# EAGLE schematic BB-cape (EAGLE 9.7.0)
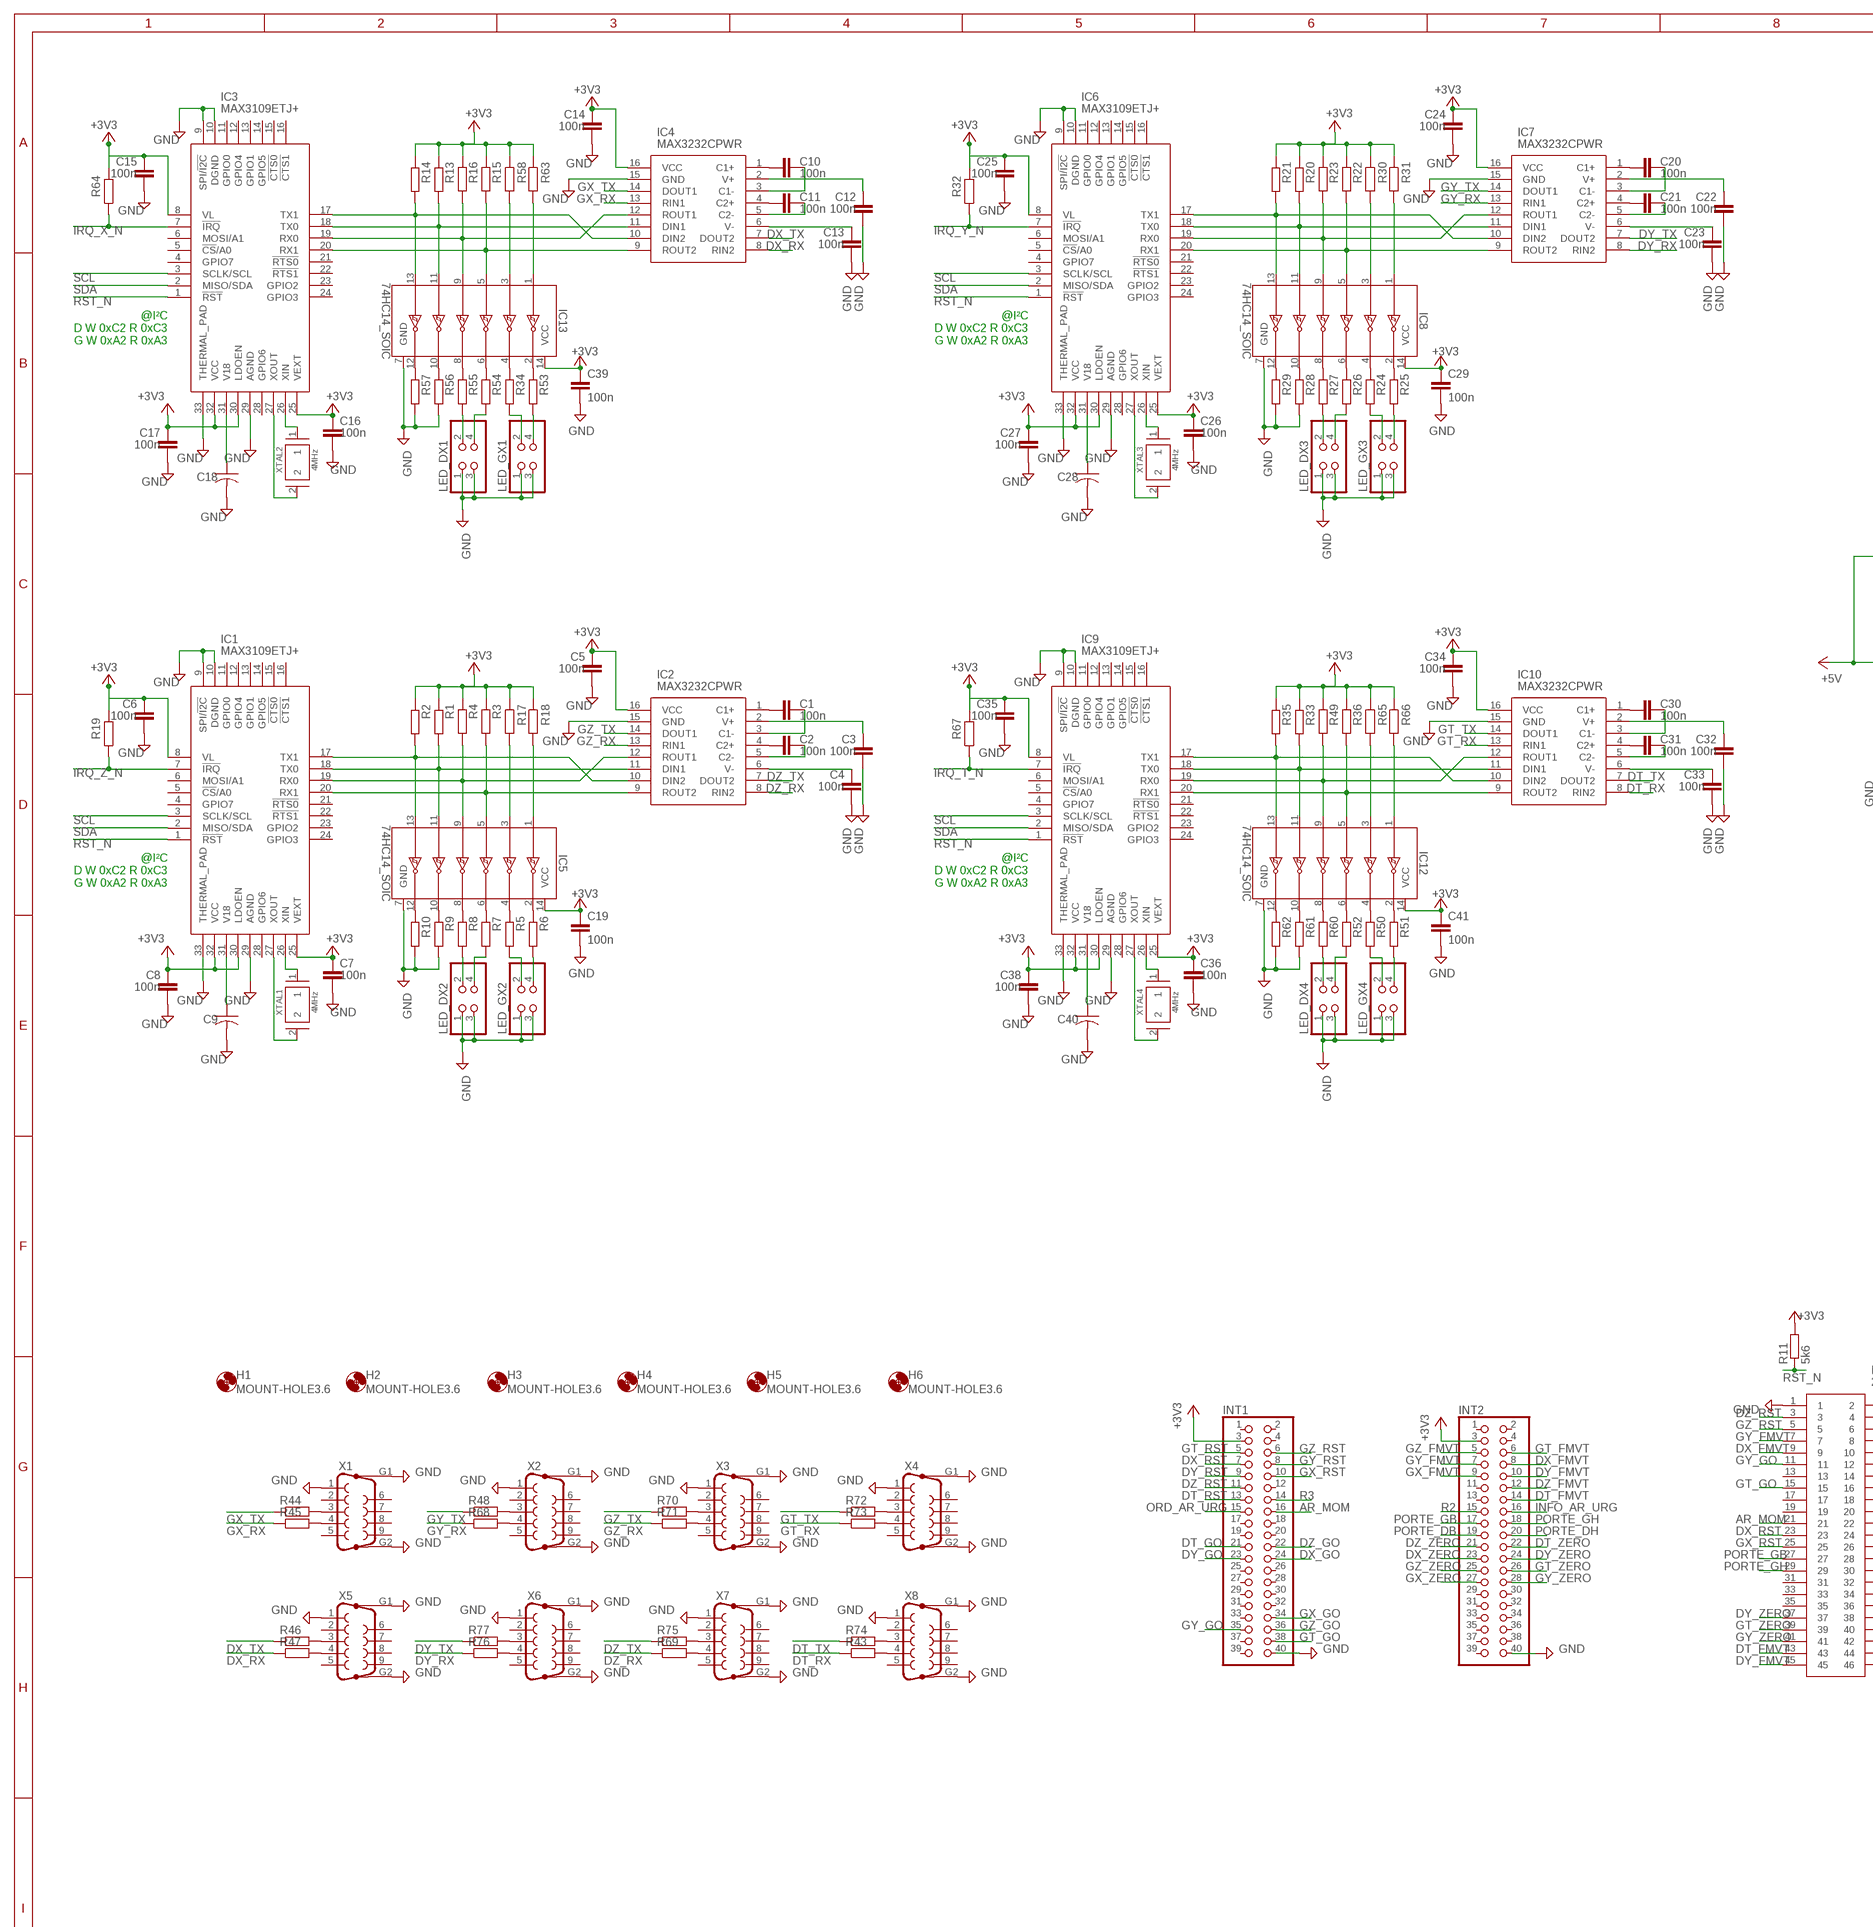
[diagram p0: schematic, sheet 1, part 1 of 2]
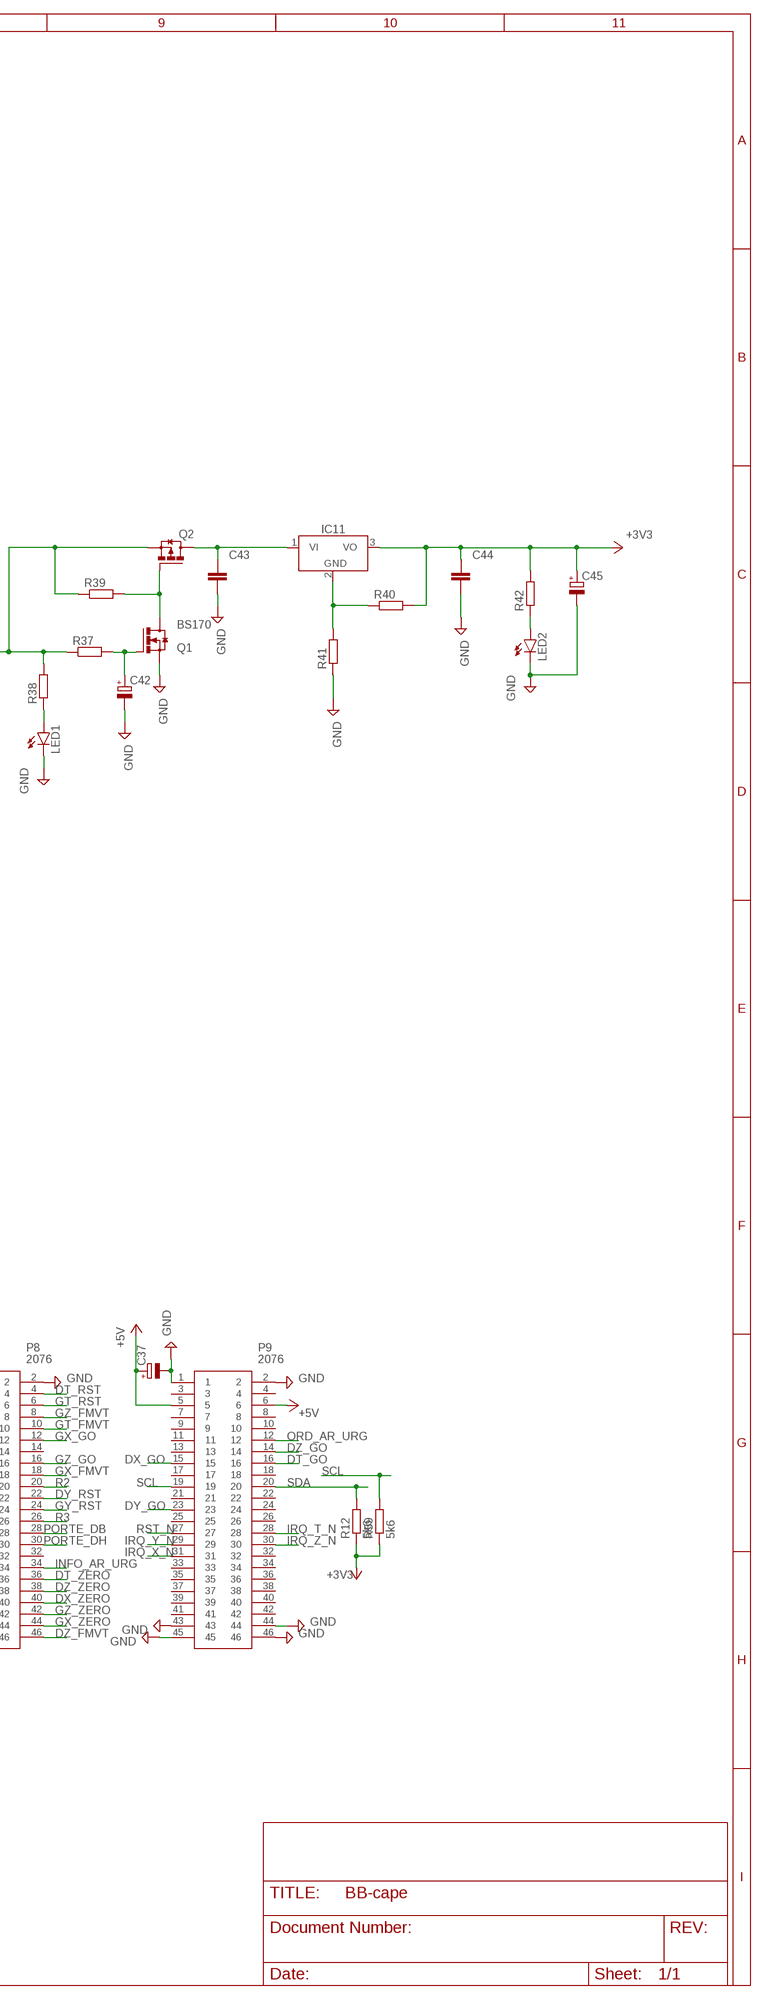
[diagram p1: schematic, sheet 1, part 2 of 2]

## Parts
C1  100n  C-EUC0603  [C0603]
C2  100n  C-EUC0603  [C0603]
C3  100n  C-EUC0603  [C0603]
C4  100n  C-EUC0603  [C0603]
C5  100n  C-EUC0603  [C0603]
C6  100n  C-EUC0603  [C0603]
C7  100n  C-EUC0603  [C0603]
C8  100n  C-EUC0603  [C0603]
C9  C-USC1206  [C1206]
C10  100n  C-EUC0603  [C0603]
C11  100n  C-EUC0603  [C0603]
C12  100n  C-EUC0603  [C0603]
C13  100n  C-EUC0603  [C0603]
C14  100n  C-EUC0603  [C0603]
C15  100n  C-EUC0603  [C0603]
C16  100n  C-EUC0603  [C0603]
C17  100n  C-EUC0603  [C0603]
C18  C-USC1206  [C1206]
C19  100n  C-EUC0603  [C0603]
C20  100n  C-EUC0603  [C0603]
C21  100n  C-EUC0603  [C0603]
C22  100n  C-EUC0603  [C0603]
C23  100n  C-EUC0603  [C0603]
C24  100n  C-EUC0603  [C0603]
C25  100n  C-EUC0603  [C0603]
C26  100n  C-EUC0603  [C0603]
C27  100n  C-EUC0603  [C0603]
C28  C-USC1206  [C1206]
C29  100n  C-EUC0603  [C0603]
C30  100n  C-EUC0603  [C0603]
C31  100n  C-EUC0603  [C0603]
C32  100n  C-EUC0603  [C0603]
C33  100n  C-EUC0603  [C0603]
C34  100n  C-EUC0603  [C0603]
C35  100n  C-EUC0603  [C0603]
C36  100n  C-EUC0603  [C0603]
C37  CPOL-EUE2.5-6  [E2,5-6]
C38  100n  C-EUC0603  [C0603]
C39  100n  C-EUC0603  [C0603]
C40  C-USC1206  [C1206]
C41  100n  C-EUC0603  [C0603]
C42  CPOL-EUE2.5-6  [E2,5-6]
C43  C_CHIP-1210(3225-METRIC)  [CAPC3225X135]
C44  C_CHIP-1210(3225-METRIC)  [CAPC3225X135]
C45  CPOL-EUE2.5-6  [E2,5-6]
H1  MOUNT-HOLE3.6  [3,6]
H2  MOUNT-HOLE3.6  [3,6]
H3  MOUNT-HOLE3.6  [3,6]
H4  MOUNT-HOLE3.6  [3,6]
H5  MOUNT-HOLE3.6  [3,6]
H6  MOUNT-HOLE3.6  [3,6]
IC1  MAX3109ETJ+  [QFN50P500X500X80-33N]
IC2  MAX3232CPWR  [SOP65P640X120-16N]
IC3  MAX3109ETJ+  [QFN50P500X500X80-33N]
IC4  MAX3232CPWR  [SOP65P640X120-16N]
IC5  74HC14_SOIC  [SOIC127P600X175-14N]
IC6  MAX3109ETJ+  [QFN50P500X500X80-33N]
IC7  MAX3232CPWR  [SOP65P640X120-16N]
IC8  74HC14_SOIC  [SOIC127P600X175-14N]
IC9  MAX3109ETJ+  [QFN50P500X500X80-33N]
IC10  MAX3232CPWR  [SOP65P640X120-16N]
IC11  LM7805_TO220V  [TO220V]
IC12  74HC14_SOIC  [SOIC127P600X175-14N]
IC13  74HC14_SOIC  [SOIC127P600X175-14N]
INT1  PINHD-2X20  [2X20]
INT2  PINHD-2X20  [2X20]
LED1  TLLY4400  [LED3MM]
LED2  TLLY4400  [LED3MM]
LED_DX1  PINHD-2X2  [2X02]
LED_DX2  PINHD-2X2  [2X02]
LED_DX3  PINHD-2X2  [2X02]
LED_DX4  PINHD-2X2  [2X02]
LED_GX1  PINHD-2X2  [2X02]
LED_GX2  PINHD-2X2  [2X02]
LED_GX3  PINHD-2X2  [2X02]
LED_GX4  PINHD-2X2  [2X02]
P8  2076  [HDRV46W64P254_2X23_5842X500X87]
P9  2076  [HDRV46W64P254_2X23_5842X500X87]
Q1  BS170  [TO92-3]
Q2  IRF9540PBF  [TO-220]
R1  R-EU_R0603  [R0603]
R2  R-EU_R0603  [R0603]
R3  R-EU_R0603  [R0603]
R4  R-EU_R0603  [R0603]
R5  R-EU_R0603  [R0603]
R6  R-EU_R0603  [R0603]
R7  R-EU_R0603  [R0603]
R8  R-EU_R0603  [R0603]
R9  R-EU_R0603  [R0603]
R10  R-EU_R0603  [R0603]
R11  5k6  R-EU_R0603  [R0603]
R12  5k6  R-EU_R0603  [R0603]
R13  R-EU_R0603  [R0603]
R14  R-EU_R0603  [R0603]
R15  R-EU_R0603  [R0603]
R16  R-EU_R0603  [R0603]
R17  R-EU_R0603  [R0603]
R18  R-EU_R0603  [R0603]
R19  R-EU_R0603  [R0603]
R20  R-EU_R0603  [R0603]
R21  R-EU_R0603  [R0603]
R22  R-EU_R0603  [R0603]
R23  R-EU_R0603  [R0603]
R24  R-EU_R0603  [R0603]
R25  R-EU_R0603  [R0603]
R26  R-EU_R0603  [R0603]
R27  R-EU_R0603  [R0603]
R28  R-EU_R0603  [R0603]
R29  R-EU_R0603  [R0603]
R30  R-EU_R0603  [R0603]
R31  R-EU_R0603  [R0603]
R32  R-EU_R0603  [R0603]
R33  R-EU_R0603  [R0603]
R34  R-EU_R0603  [R0603]
R35  R-EU_R0603  [R0603]
R36  R-EU_R0603  [R0603]
R37  R-EU_R0603  [R0603]
R38  R-EU_R0603  [R0603]
R39  R-EU_R0603  [R0603]
R40  R-EU_R0603  [R0603]
R41  R-EU_R0603  [R0603]
R42  R-EU_R0603  [R0603]
R43  R-EU_R0603  [R0603]
R44  R-EU_R0603  [R0603]
R45  R-EU_R0603  [R0603]
R46  R-EU_R0603  [R0603]
R47  R-EU_R0603  [R0603]
R48  R-EU_R0603  [R0603]
R49  R-EU_R0603  [R0603]
R50  R-EU_R0603  [R0603]
R51  R-EU_R0603  [R0603]
R52  R-EU_R0603  [R0603]
R53  R-EU_R0603  [R0603]
R54  R-EU_R0603  [R0603]
R55  R-EU_R0603  [R0603]
R56  R-EU_R0603  [R0603]
R57  R-EU_R0603  [R0603]
R58  R-EU_R0603  [R0603]
R59  5k6  R-EU_R0603  [R0603]
R60  R-EU_R0603  [R0603]
R61  R-EU_R0603  [R0603]
R62  R-EU_R0603  [R0603]
R63  R-EU_R0603  [R0603]
R64  R-EU_R0603  [R0603]
R65  R-EU_R0603  [R0603]
R66  R-EU_R0603  [R0603]
R67  R-EU_R0603  [R0603]
R68  R-EU_R0603  [R0603]
R69  R-EU_R0603  [R0603]
R70  R-EU_R0603  [R0603]
R71  R-EU_R0603  [R0603]
R72  R-EU_R0603  [R0603]
R73  R-EU_R0603  [R0603]
R74  R-EU_R0603  [R0603]
R75  R-EU_R0603  [R0603]
R76  R-EU_R0603  [R0603]
R77  R-EU_R0603  [R0603]
X1  F09HP  [F09HP]
X2  F09HP  [F09HP]
X3  F09HP  [F09HP]
X4  F09HP  [F09HP]
X5  F09HP  [F09HP]
X6  F09HP  [F09HP]
X7  F09HP  [F09HP]
X8  F09HP  [F09HP]
XTAL1  4MHz  ABLS  [XTAL1147X477X420N]
XTAL2  4MHz  ABLS  [XTAL1147X477X420N]
XTAL3  4MHz  ABLS  [XTAL1147X477X420N]
XTAL4  4MHz  ABLS  [XTAL1147X477X420N]

## Nets
+3V3: C5.1 C6.1 C7.2 C8.2 C14.1 C15.1 C16.2 C17.2 C19.2 C24.1 C25.1 C26.2 C27.2 C29.2 C34.1 C35.1 C36.2 C38.2 C39.2 C41.2 C44.1 C45.+ IC1.8(VL) IC1.25(VEXT) IC1.30(LDOEN) IC1.32(VCC) IC2.16(VCC) IC3.8(VL) IC3.25(VEXT) IC3.30(LDOEN) IC3.32(VCC) IC4.16(VCC) IC5.14(VCC) IC6.8(VL) IC6.25(VEXT) IC6.30(LDOEN) IC6.32(VCC) IC7.16(VCC) IC8.14(VCC) IC9.8(VL) IC9.25(VEXT) IC9.30(LDOEN) IC9.32(VCC) IC10.16(VCC) IC11.3(VO) IC12.14(VCC) IC13.14(VCC) INT1.3 INT2.3 R1.1 R2.1 R3.2 R4.2 R11.2 R12.1 R13.1 R14.1 R15.2 R16.2 R17.1 R18.1 R19.2 R20.1 R21.1 R22.2 R23.2 R30.1 R31.1 R32.2 R33.1 R35.1 R36.2 R40.2 R42.2 R49.2 R58.1 R59.1 R63.1 R64.2 R65.1 R66.1 R67.2
+5V: C37.+ P9.5 P9.6 Q2.S R37.1 R38.2 R39.1
AR_MOM: INT1.16 P8.21
DT_FMVT: INT2.14 P8.43
DT_GO: INT1.21 P9.16
DT_RST: INT1.13 P8.4
DT_RX: IC10.8(RIN2) R43.1
DT_TX: IC10.7(DOUT2) R74.1
DT_ZERO: INT2.22 P8.36
DX_FMVT: INT2.8 P8.9
DX_GO: INT1.24 P9.15
DX_RST: INT1.7 P8.23
DX_RX: IC4.8(RIN2) R47.1
DX_TX: IC4.7(DOUT2) R46.1
DX_ZERO: INT2.23 P8.40
DY_FMVT: INT2.10 P8.45
DY_GO: INT1.23 P9.23
DY_RST: INT1.9 P8.22
DY_RX: IC7.8(RIN2) R76.1
DY_TX: IC7.7(DOUT2) R77.1
DY_ZERO: INT2.24 P8.37
DZ_FMVT: INT2.12 P8.46
DZ_GO: INT1.22 P9.14
DZ_RST: INT1.11 P8.3
DZ_RX: IC2.8(RIN2) R69.1
DZ_TX: IC2.7(DOUT2) R75.1
DZ_ZERO: INT2.21 P8.38
GND: C3.1 C4.2 C5.2 C6.2 C7.1 C8.1 C9.2 C12.1 C13.2 C14.2 C15.2 C16.1 C17.1 C18.2 C19.1 C22.1 C23.2 C24.2 C25.2 C26.1 C27.1 C28.2 C29.1 C32.1 C33.2 C34.2 C35.2 C36.1 C37.- C38.1 C39.1 C40.2 C41.1 C42.- C43.2 C44.2 C45.- IC1.9(SPI/!I2C) IC1.10(DGND) IC1.29(AGND) IC1.33(THERMAL_PAD) IC2.15(GND) IC3.9(SPI/!I2C) IC3.10(DGND) IC3.29(AGND) IC3.33(THERMAL_PAD) IC4.15(GND) IC5.7(GND) IC6.9(SPI/!I2C) IC6.10(DGND) IC6.29(AGND) IC6.33(THERMAL_PAD) IC7.15(GND) IC8.7(GND) IC9.9(SPI/!I2C) IC9.10(DGND) IC9.29(AGND) IC9.33(THERMAL_PAD) IC10.15(GND) IC12.7(GND) IC13.7(GND) INT1.40 INT2.40 LED1.K(C) LED2.K(C) LED_DX1.1 LED_DX1.3 LED_DX2.1 LED_DX2.3 LED_DX3.1 LED_DX3.3 LED_DX4.1 LED_DX4.3 LED_GX1.1 LED_GX1.3 LED_GX2.1 LED_GX2.3 LED_GX3.1 LED_GX3.3 LED_GX4.1 LED_GX4.3 P8.1 P8.2 P9.1 P9.2 P9.43 P9.44 P9.45 P9.46 Q1.3(S) R9.2 R10.2 R28.2 R29.2 R41.1 R56.2 R57.2 R61.2 R62.2 X1.1 X1.G1 X1.G2 X2.1 X2.G1 X2.G2 X3.1 X3.G1 X3.G2 X4.1 X4.G1 X4.G2 X5.1 X5.G1 X5.G2 X6.1 X6.G1 X6.G2 X7.1 X7.G1 X7.G2 X8.1 X8.G1 X8.G2
GT_FMVT: INT2.6 P8.10
GT_GO: INT1.38 P8.15
GT_RST: INT1.5 P8.6
GT_RX: IC10.13(RIN1) R73.1
GT_TX: IC10.14(DOUT1) R72.1
GT_ZERO: INT2.26 P8.39
GX_FMVT: INT2.9 P8.18
GX_GO: INT1.34 P8.12
GX_RST: INT1.10 P8.25
GX_RX: IC4.13(RIN1) R45.1
GX_TX: IC4.14(DOUT1) R44.1
GX_ZERO: INT2.27 P8.44
GY_FMVT: INT2.7 P8.7
GY_GO: INT1.35 P8.11
GY_RST: INT1.8 P8.24
GY_RX: IC7.13(RIN1) R68.1
GY_TX: IC7.14(DOUT1) R48.1
GY_ZERO: INT2.28 P8.41
GZ_FMVT: INT2.5 P8.8
GZ_GO: INT1.36 P8.16
GZ_RST: INT1.6 P8.5
GZ_RX: IC2.13(RIN1) R71.1
GZ_TX: IC2.14(DOUT1) R70.1
GZ_ZERO: INT2.25 P8.42
INFO_AR_URG: INT2.16 P8.34
IRQ_T_N: IC9.7(!IRQ) P9.28 R67.1
IRQ_X_N: IC3.7(!IRQ) P9.31 R64.1
IRQ_Y_N: IC6.7(!IRQ) P9.29 R32.1
IRQ_Z_N: IC1.7(!IRQ) P9.30 R19.1
N$1: C3.2 IC2.2(V+)
N$2: C1.1 IC2.3(C1-)
N$3: C2.1 IC2.5(C2-)
N$4: C4.1 IC2.6(V-)
N$5: IC1.26(XIN) XTAL1.1
N$6: IC1.27(XOUT) XTAL1.2
N$7: C42.+ Q1.2(G) R37.2
N$8: LED_DX2.2 R8.2
N$9: LED_DX2.4 R7.2
N$10: LED_GX2.2 R5.2
N$11: LED1.A R38.1
N$12: C12.2 IC4.2(V+)
N$13: Q1.1(D) Q2.G R39.2
N$14: LED_GX2.4 R6.2
N$15: C9.1 IC1.31(V18)
N$16: C10.1 IC4.3(C1-)
N$17: C11.1 IC4.5(C2-)
N$18: C13.1 IC4.6(V-)
N$19: IC3.26(XIN) XTAL2.1
N$20: IC3.27(XOUT) XTAL2.2
N$21: C43.1 IC11.1(VI) Q2.D
N$22: IC11.2(GND) R40.1 R41.2
N$23: IC1.17(TX1) IC2.10(DIN2) IC5.13(6A) R2.2
N$24: IC1.18(TX0) IC2.11(DIN1) IC5.11(5A) R1.2
N$25: IC1.19(RX0) IC2.12(ROUT1) IC5.9(4A) R4.1
N$26: LED_DX1.2 R55.2
N$27: IC1.20(RX1) IC2.9(ROUT2) IC5.5(3A) R3.1
N$28: IC5.3(2A) R17.2
N$29: IC5.1(1A) R18.2
N$30: C1.2 IC2.1(C1+)
N$31: R44.2 X1.3
N$32: LED2.A R42.1
N$33: R45.2 X1.4
N$34: C2.2 IC2.4(C2+)
N$35: IC5.4(2Y) R5.1
N$36: IC5.2(1Y) R6.1
N$37: IC5.6(3Y) R7.1
N$38: IC5.8(4Y) R8.1
N$39: IC5.10(5Y) R9.1
N$40: IC5.12(6Y) R10.1
N$41: C22.2 IC7.2(V+)
N$42: C20.1 IC7.3(C1-)
N$43: C21.1 IC7.5(C2-)
N$44: C23.1 IC7.6(V-)
N$45: IC6.26(XIN) XTAL3.1
N$46: IC6.27(XOUT) XTAL3.2
N$47: LED_DX3.2 R27.2
N$48: LED_DX3.4 R26.2
N$49: LED_GX3.2 R24.2
N$50: LED_GX3.4 R25.2
N$51: C28.1 IC6.31(V18)
N$52: IC6.17(TX1) IC7.10(DIN2) IC8.13(6A) R21.2
N$53: IC6.18(TX0) IC7.11(DIN1) IC8.11(5A) R20.2
N$54: IC6.19(RX0) IC7.12(ROUT1) IC8.9(4A) R23.1
N$55: IC6.20(RX1) IC7.9(ROUT2) IC8.5(3A) R22.1
N$56: IC8.3(2A) R30.2
N$57: IC8.1(1A) R31.2
N$58: C20.2 IC7.1(C1+)
N$59: C21.2 IC7.4(C2+)
N$60: IC8.4(2Y) R24.1
N$61: IC8.2(1Y) R25.1
N$62: IC8.6(3Y) R26.1
N$63: IC8.8(4Y) R27.1
N$64: IC8.10(5Y) R28.1
N$65: IC8.12(6Y) R29.1
N$66: C32.2 IC10.2(V+)
N$67: C30.1 IC10.3(C1-)
N$68: C31.1 IC10.5(C2-)
N$69: C33.1 IC10.6(V-)
N$70: LED_DX1.4 R54.2
N$71: LED_GX1.2 R34.2
N$72: IC9.26(XIN) XTAL4.1
N$73: LED_GX1.4 R53.2
N$74: C18.1 IC3.31(V18)
N$75: IC9.27(XOUT) XTAL4.2
N$76: LED_DX4.2 R60.2
N$77: IC3.17(TX1) IC4.10(DIN2) IC13.13(6A) R14.2
N$78: R46.2 X5.3
N$79: IC3.18(TX0) IC4.11(DIN1) IC13.11(5A) R13.2
N$80: LED_DX4.4 R52.2
N$81: IC3.19(RX0) IC4.12(ROUT1) IC13.9(4A) R16.1
N$82: LED_GX4.2 R50.2
N$83: LED_GX4.4 R51.2
N$84: IC3.20(RX1) IC4.9(ROUT2) IC13.5(3A) R15.1
N$85: C40.1 IC9.31(V18)
N$86: IC9.17(TX1) IC10.10(DIN2) IC12.13(6A) R35.2
N$87: IC13.3(2A) R58.2
N$88: IC9.18(TX0) IC10.11(DIN1) IC12.11(5A) R33.2
N$89: IC9.19(RX0) IC10.12(ROUT1) IC12.9(4A) R49.1
N$90: IC13.1(1A) R63.2
N$91: IC9.20(RX1) IC10.9(ROUT2) IC12.5(3A) R36.1
N$92: IC12.3(2A) R65.2
N$93: R47.2 X5.4
N$94: R48.2 X2.3
N$95: R68.2 X2.4
N$96: R70.2 X3.3
N$97: R71.2 X3.4
N$98: R69.2 X7.4
N$99: R72.2 X4.3
N$100: R73.2 X4.4
N$101: IC12.1(1A) R66.2
N$102: C30.2 IC10.1(C1+)
N$103: C31.2 IC10.4(C2+)
N$104: IC12.4(2Y) R50.1
N$105: IC12.2(1Y) R51.1
N$106: IC12.6(3Y) R52.1
N$107: C10.2 IC4.1(C1+)
N$108: C11.2 IC4.4(C2+)
N$109: R74.2 X8.3
N$110: R43.2 X8.4
N$111: IC13.4(2Y) R34.1
N$112: IC13.2(1Y) R53.1
N$113: IC12.8(4Y) R60.1
N$114: IC12.10(5Y) R61.1
N$115: IC13.6(3Y) R54.1
N$116: IC13.8(4Y) R55.1
N$117: IC12.12(6Y) R62.1
N$118: R75.2 X7.3
N$119: R76.2 X6.4
N$120: R77.2 X6.3
N$123: IC13.10(5Y) R56.1
N$124: IC13.12(6Y) R57.1
ORD_AR_URG: INT1.15 P9.12
PORTE_DB: INT2.19 P8.28
PORTE_DH: INT2.20 P8.30
PORTE_GB: INT2.17 P8.27
PORTE_GH: INT2.18 P8.29
R2: INT2.15 P8.20
R3: INT1.14 P8.26
RST_N: IC1.1(!RST) IC3.1(!RST) IC6.1(!RST) IC9.1(!RST) P9.27 R11.1
SCL: IC1.3(SCLK/SCL) IC3.3(SCLK/SCL) IC6.3(SCLK/SCL) IC9.3(SCLK/SCL) P9.19 R59.2
SDA: IC1.2(MISO/SDA) IC3.2(MISO/SDA) IC6.2(MISO/SDA) IC9.2(MISO/SDA) P9.20 R12.2
Unconnected: IC1.4(GPIO7) IC1.5(!CS!/A0) IC1.6(MOSI/A1) IC1.11(GPIO0) IC1.12(GPIO4) IC1.13(GPIO1) IC1.14(GPIO5) IC1.15(!CTS0) IC1.16(!CTS1) IC1.21(!RTS0) IC1.22(!RTS1) IC1.23(GPIO2) IC1.24(GPIO3) IC1.28(GPIO6) IC3.4(GPIO7) IC3.5(!CS!/A0) IC3.6(MOSI/A1) IC3.11(GPIO0) IC3.12(GPIO4) IC3.13(GPIO1) IC3.14(GPIO5) IC3.15(!CTS0) IC3.16(!CTS1) IC3.21(!RTS0) IC3.22(!RTS1) IC3.23(GPIO2) IC3.24(GPIO3) IC3.28(GPIO6) IC6.4(GPIO7) IC6.5(!CS!/A0) IC6.6(MOSI/A1) IC6.11(GPIO0) IC6.12(GPIO4) IC6.13(GPIO1) IC6.14(GPIO5) IC6.15(!CTS0) IC6.16(!CTS1) IC6.21(!RTS0) IC6.22(!RTS1) IC6.23(GPIO2) IC6.24(GPIO3) IC6.28(GPIO6) IC9.4(GPIO7) IC9.5(!CS!/A0) IC9.6(MOSI/A1) IC9.11(GPIO0) IC9.12(GPIO4) IC9.13(GPIO1) IC9.14(GPIO5) IC9.15(!CTS0) IC9.16(!CTS1) IC9.21(!RTS0) IC9.22(!RTS1) IC9.23(GPIO2) IC9.24(GPIO3) IC9.28(GPIO6) INT1.1 INT1.2 INT1.4 INT1.12 INT1.17 INT1.18 INT1.19 INT1.20 INT1.25 INT1.26 INT1.27 INT1.28 INT1.29 INT1.30 INT1.31 INT1.32 INT1.33 INT1.37 INT1.39 INT2.1 INT2.2 INT2.4 INT2.11 INT2.13 INT2.29 INT2.30 INT2.31 INT2.32 INT2.33 INT2.34 INT2.35 INT2.36 INT2.37 INT2.38 INT2.39 P8.13 P8.14 P8.17 P8.19 P8.31 P8.32 P8.33 P8.35 P9.3 P9.4 P9.7 P9.8 P9.9 P9.10 P9.11 P9.13 P9.17 P9.18 P9.21 P9.22 P9.24 P9.25 P9.26 P9.32 P9.33 P9.34 P9.35 P9.36 P9.37 P9.38 P9.39 P9.40 P9.41 P9.42 X1.2 X1.5 X1.6 X1.7 X1.8 X1.9 X2.2 X2.5 X2.6 X2.7 X2.8 X2.9 X3.2 X3.5 X3.6 X3.7 X3.8 X3.9 X4.2 X4.5 X4.6 X4.7 X4.8 X4.9 X5.2 X5.5 X5.6 X5.7 X5.8 X5.9 X6.2 X6.5 X6.6 X6.7 X6.8 X6.9 X7.2 X7.5 X7.6 X7.7 X7.8 X7.9 X8.2 X8.5 X8.6 X8.7 X8.8 X8.9

## Notes on the sheet
- @I²C
  D W 0xC2 R 0xC3
  G W 0xA2 R 0xA3
- @I²C
  D W 0xC2 R 0xC3
  G W 0xA2 R 0xA3
- @I²C
  D W 0xC2 R 0xC3
  G W 0xA2 R 0xA3
- @I²C
  D W 0xC2 R 0xC3
  G W 0xA2 R 0xA3

## Library data of the parts
C1-C8 C10-C17 C19-C27 C29-C36 C38 C39 C41 = rcl:C-EU: CAPACITOR, European symbol; SPICEPREFIX: C
C9 C18 C28 C40 = resistor:C-US: CAPACITOR, American symbol
C37 C42 C45 = rcl:CPOL-EU: POLARIZED CAPACITOR, European symbol; SPICEPREFIX: C
C43 C44 = Capacitor:C: Capacitor - Generic; CATEGORY: Capacitor
H1-H6 = holes:MOUNT-HOLE: MOUNTING HOLE with drill center marker
IC1 IC3 IC6 IC9 = SamacSys_Parts:MAX3109ETJ+: Maxim MAX3109ETJ+ Interface RS232, RS485 24MBps, 1.71 3.6 V, 32-Pin, TQFN Source: Datasheet <https://datasheets.maximintegrated.com/en/ds/MAX3109.pdf>; DESCRIPTION: Maxim MAX3109ETJ+ Interface RS232, RS485 24MBps, 1.71 3.6 V, 32-Pin, TQFN; HEIGHT: 0.8mm; MANUFACTURER_NAME: Analog Devices; MANUFACTURER_PART_NUMBER: MAX3109ETJ+; MOUSER_PART_NUMBER: 700-MAX3109ETJ+; MOUSER_PRICE-STOCK: https://www.mouser.co.uk/ProductDetail/Maxim-Integrated/MAX3109ETJ%2b?qs=LbY2dft4ljDeDesM43WgxA%3D%3D
IC2 IC4 IC7 IC10 = SamacSys_Parts:MAX3232CPWR: 3-V to 5.5-V multichannel RS-232 line driver & receiver Source: Datasheet <http://www.ti.com/lit/gpn/max3232>; ARROW_PART_NUMBER: MAX3232CPWR; ARROW_PRICE-STOCK: https://www.arrow.com/en/products/max3232cpwr/texas-instruments?region=nac; DESCRIPTION: 3-V to 5.5-V multichannel RS-232 line driver & receiver; HEIGHT: 1.2mm; MANUFACTURER_NAME: Texas Instruments; MANUFACTURER_PART_NUMBER: MAX3232CPWR; MOUSER_PART_NUMBER: 595-MAX3232CPWR; MOUSER_PRICE-STOCK: https://www.mouser.co.uk/ProductDetail/Texas-Instruments/MAX3232CPWR?qs=bkMXpVdiF40tDMAEI%2F4vWA%3D%3D
IC5 IC8 IC12 IC13 = IC_Logic:74HC14: Hex Inverters with Schmitt trigger Reference Datasheet <https://www.ti.com/lit/ds/symlink/sn74hc14.pdf?ts=1637585789037>; CATEGORY: IC_Logic; DESCRIPTION: Hex Inverters; MANUFACTURER: Generic; MPN: Generic; SUB-CATEGORY: Inverter; TYPE: Hex
IC11 = IC_Power-Management:LM7805: 5V Voltage Regulator Reference Datasheet <https://www.ti.com/lit/ds/symlink/lm340.pdf>; CATEGORY: IC_Linear; DESCRIPTION: 5V Voltage Regulator; MANUFACTURER: Generic; MPN: Generic; SERIES: LM7805; SUB-CATEGORY: Voltage Regulator; TYPE: 5V
INT1 INT2 = pinhead:PINHD-2X20: PIN HEADER
LED1 LED2 = led:TLLY4400: Low Current (2mA) LED 3 mm Tinted Diffused Package color YELLOW Source: Data sheet <http://www.farnell.com/datasheets/391098.pdf>; MF: VISHAY SEMICONDUCTOR; OC_FARNELL: 1612439
LED_DX1-LED_DX4 LED_GX1-LED_GX4 = pinhead:PINHD-2X2: PIN HEADER
P8 P9 = SamacSys_Parts:2076: Adafruit Accessories 2x23 Male Headers for BeagleBone Black - Two Pack Source: Datasheet <https://cdn-shop.adafruit.com/datasheets/16188.pdf>; ARROW_PART_NUMBER: 2076; ARROW_PRICE-STOCK: https://www.arrow.com/en/products/2076/adafruit-industries?region=nac; DESCRIPTION: Adafruit Accessories 2x23 Male Headers for BeagleBone Black - Two Pack; HEIGHT: 8.74mm; MANUFACTURER_NAME: Adafruit; MANUFACTURER_PART_NUMBER: 2076; MOUSER_PART_NUMBER: 485-2076; MOUSER_PRICE-STOCK: https://www.mouser.co.uk/ProductDetail/Adafruit/2076?qs=GURawfaeGuBAvD7rncVFUg%3D%3D
Q1 = Transistor:BS170: MOSFET N-CH 60V 300MA TO92-3 Manufacturer's datasheet <https://rocelec.widen.net/view/pdf/fonxoqycul/FAIRS29185-1.pdf?t.download=true&u=5oefqw>; CREATED_BY: PCBLayout.com; DIGIKEY_PART_NUMBER: 2156-BS170-ND; MANUFACTURER: Fairchild Semiconductor; MPN: BS170; PACKAGE: TO92-3
Q2 = Transistor:IRF9540PBF: MOSFET P-CH 100V 19A TO220AB Manufacturer's datasheet <https://www.vishay.com/docs/91078/91078.pdf>; CREATED_BY: PCBLayout.com; DIGIKEY_PART_NUMBER: IRF9540PBF-ND; MANUFACTURER: Vishay Siliconix; MPN: IRF9540PBF; PACKAGE: TO-220AB
R1-R77 = resistor:R-EU_: RESISTOR, European symbol
X1-X8 = con-subd:F09HP: SUB-D; OC_FARNELL: unknown; OC_NEWARK: unknown
XTAL1-XTAL4 = Frequency-Source:ABLS: HC/49US (AT49) SMD LOW PROFILE CRYSTAL Datasheet <https://abracon.com/Resonators/abls.pdf>; CATEGORY: HC/49US (AT49) SMD LOW PROFILE CRYSTAL; DESCRIPTION: Crystal 16MHZ SMD 11.5 x 4.7 x 4.2 mm; FREQUENCY: 16MHZ; MANUFACTURER: ABRACON; MPN: ABLS-16.000MHZ-S-R500MD2XF; OPERATING_TEMPERATURE: -40°C ~ +85°C; PART_STATUS: ACTIVE; ROHS_COMPLIANT: COMPLIANT; SERIES: ABLS; SUB_CATEGORY: Crystal; TOLERANCE: 20PPM; TYPE: Low Profile Crystal; VALUE: 16MHz